# Altium schematic sheet AblationChannel.SchDoc
size A4; SheetNumber: 4; SheetTotal: 6
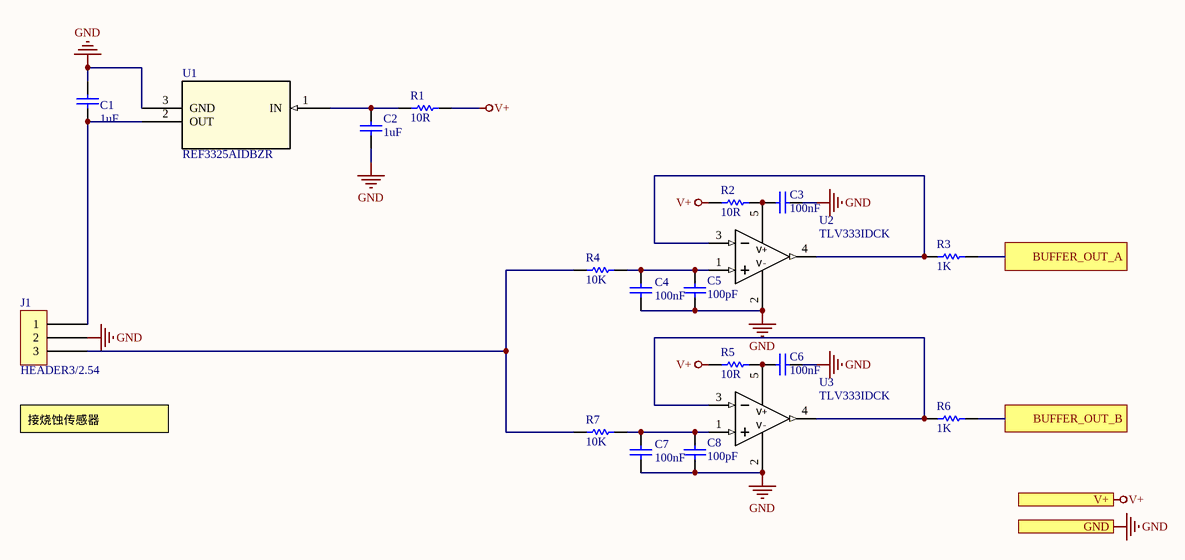
[diagram p0: AblationChannel.SchDoc]

## Parts
C1  1uF  [R0603_C]
C2  1uF  [R0603_C]
C3  100nF  [R0603_C]
C4  100nF  [R0603_C]
C5  100pF  [R0603_C]
C6  100nF  [R0603_C]
C7  100nF  [R0603_C]
C8  100pF  [R0603_C]
J1  HEADER3/2.54  [SIP3/2.54]
R1  10R  [R0603_R]
R2  10R  [R0603_R]
R3  1K  [R0603_R]
R4  10K  [R0603_R]
R5  10R  [R0603_R]
R6  1K  [R0603_R]
R7  10K  [R0603_R]
U1  REF3325AIDBZR  [SOT-23(SOT-23-3)]
U2  TLV333IDCK  [DCK0005A_N]
U3  TLV333IDCK  [DCK0005A_N]

## Ports
BUFFER_OUT_A, BUFFER_OUT_B, GND, V+

## Nets
GND: C1.1 C2.1 C3.1 C4.2 C5.1 C6.1 C7.2 C8.1 J1.2 U1.3(GND) U2.2(V-) U3.2(V-) ; port GND
V+: R1.1 R2.2 R5.2 ; port V+
BUFFER_OUT_A: R3.2 ; port BUFFER_OUT_A
BUFFER_OUT_B: R6.2 ; port BUFFER_OUT_B
NetC1_2: C1.2 J1.1 U1.2(OUT)
NetC2_2: C2.2 R1.2 U1.1(IN)
NetC3_2: C3.2 R2.1 U2.5(V+)
NetC4_1: C4.1 C5.2 R4.2 U2.1(IN+)
NetC6_2: C6.2 R5.1 U3.5(V+)
NetC7_1: C7.1 C8.2 R7.2 U3.1(IN+)
NetJ1_3: J1.3 R4.1 R7.1
NetR3_1: R3.1 U2.3(IN-) U2.4(OUT)
NetR6_1: R6.1 U3.3(IN-) U3.4(OUT)

## Notes on the sheet
- 接烧蚀传感器
- Page
- of

## Library data of the parts
C1 C2 = 1uF/0603/50V: 精度 ±10% / 容值 1uF / 额定电压 50V / 温漂系数（介质材料) X7R; 厂家: FH(风华); 型号: 0603B105K500NT; 封装: 0603; 类型: Capacitor; 订货编码: C90540
C3 C4 C6 C7 = 100nF/0603/50V: 精度 ±10% / 容值 100nF / 额定电压 50V / 温漂系数（介质材料) X7R; 厂家: FH(风华); 型号: 0603B104K500NT; 封装: 0603; 类型: Capacitor; 订货编码: C30926
C5 C8 = 100pF/0603/50V: 精度 ±5% / 容值 100pF / 额定电压 50V / 温漂系数（介质材料) C0G; 厂家: FH(风华); 型号: 0603CG101J500NT; 封装: 0603; 类型: Capacitor; 订货编码: C1635
J1 = HEADER3/2.54: 3pin,单排,2.54mm间距; 厂家: /; System: Connector; 型号: /; 封装: /; 类型: /; 订货编码: /
R1 R2 R5 = 10R/0603: 精度 ±1% / 阻值 10Ω / 温度系数 ±100ppm/℃ / 功率 0.1W; 厂家: FH(风华); 型号: RS-03K10R0FT; 类型: Resistor; 订货编码: C136596; 封装: 0603
R3 R6 = 1K/0603: 精度 ±1% / 温度系数 ±100ppm/℃ / 阻值 1kΩ / 功率 0.1W; 厂家: FH(风华); 型号: RS-03K1001FT; 类型: Resistor; 订货编码: C115325; 封装: 0603
R4 R7 = 10K/0603: 精度 ±1% / 温度系数 ±100ppm/℃ / 阻值 10kΩ / 功率 0.1W; 厂家: FH(风华); 型号: RS-03K1002FT; 类型: Resistor; 订货编码: C115324; 封装: 0603
U1 = REF3325AIDBZR: 输出电压（最小值/固定） 2.5V / 输出电流 5mA / 输出电压（最大值） - / 输入电压 2.7 V ~ 5.5 V / 电源电流 8.5uA / 输出类型 固定 / 工作温度 -40°C ~ 125°C(TA) / 温度系数 30ppm/°C / 阴极电流 - / 精度 ±0.15% / 参考源类型 系列; 厂家: TI(德州仪器); 封装: SOT23-3; 类型: 电源参考; 订货编码: C69039; 型号: REF3325AIDBZR
U2 U3 = TLV333IDCK: 电源电压 1.8V ~ 5.5V, ±0.9V ~ 2.75V / 增益带宽积（GBP） 350kHz / 压摆率（SR） 0.16 V/us / 工作温度 -40°C ~ 125°C /; 厂家: TI(德州仪器); 封装: SC-70-5; 类型: 运放; 订货编码: C181502; 型号: TLV333IDCK